# EAGLE design VoltageRegulationBoard (EAGLE 7.4.0)
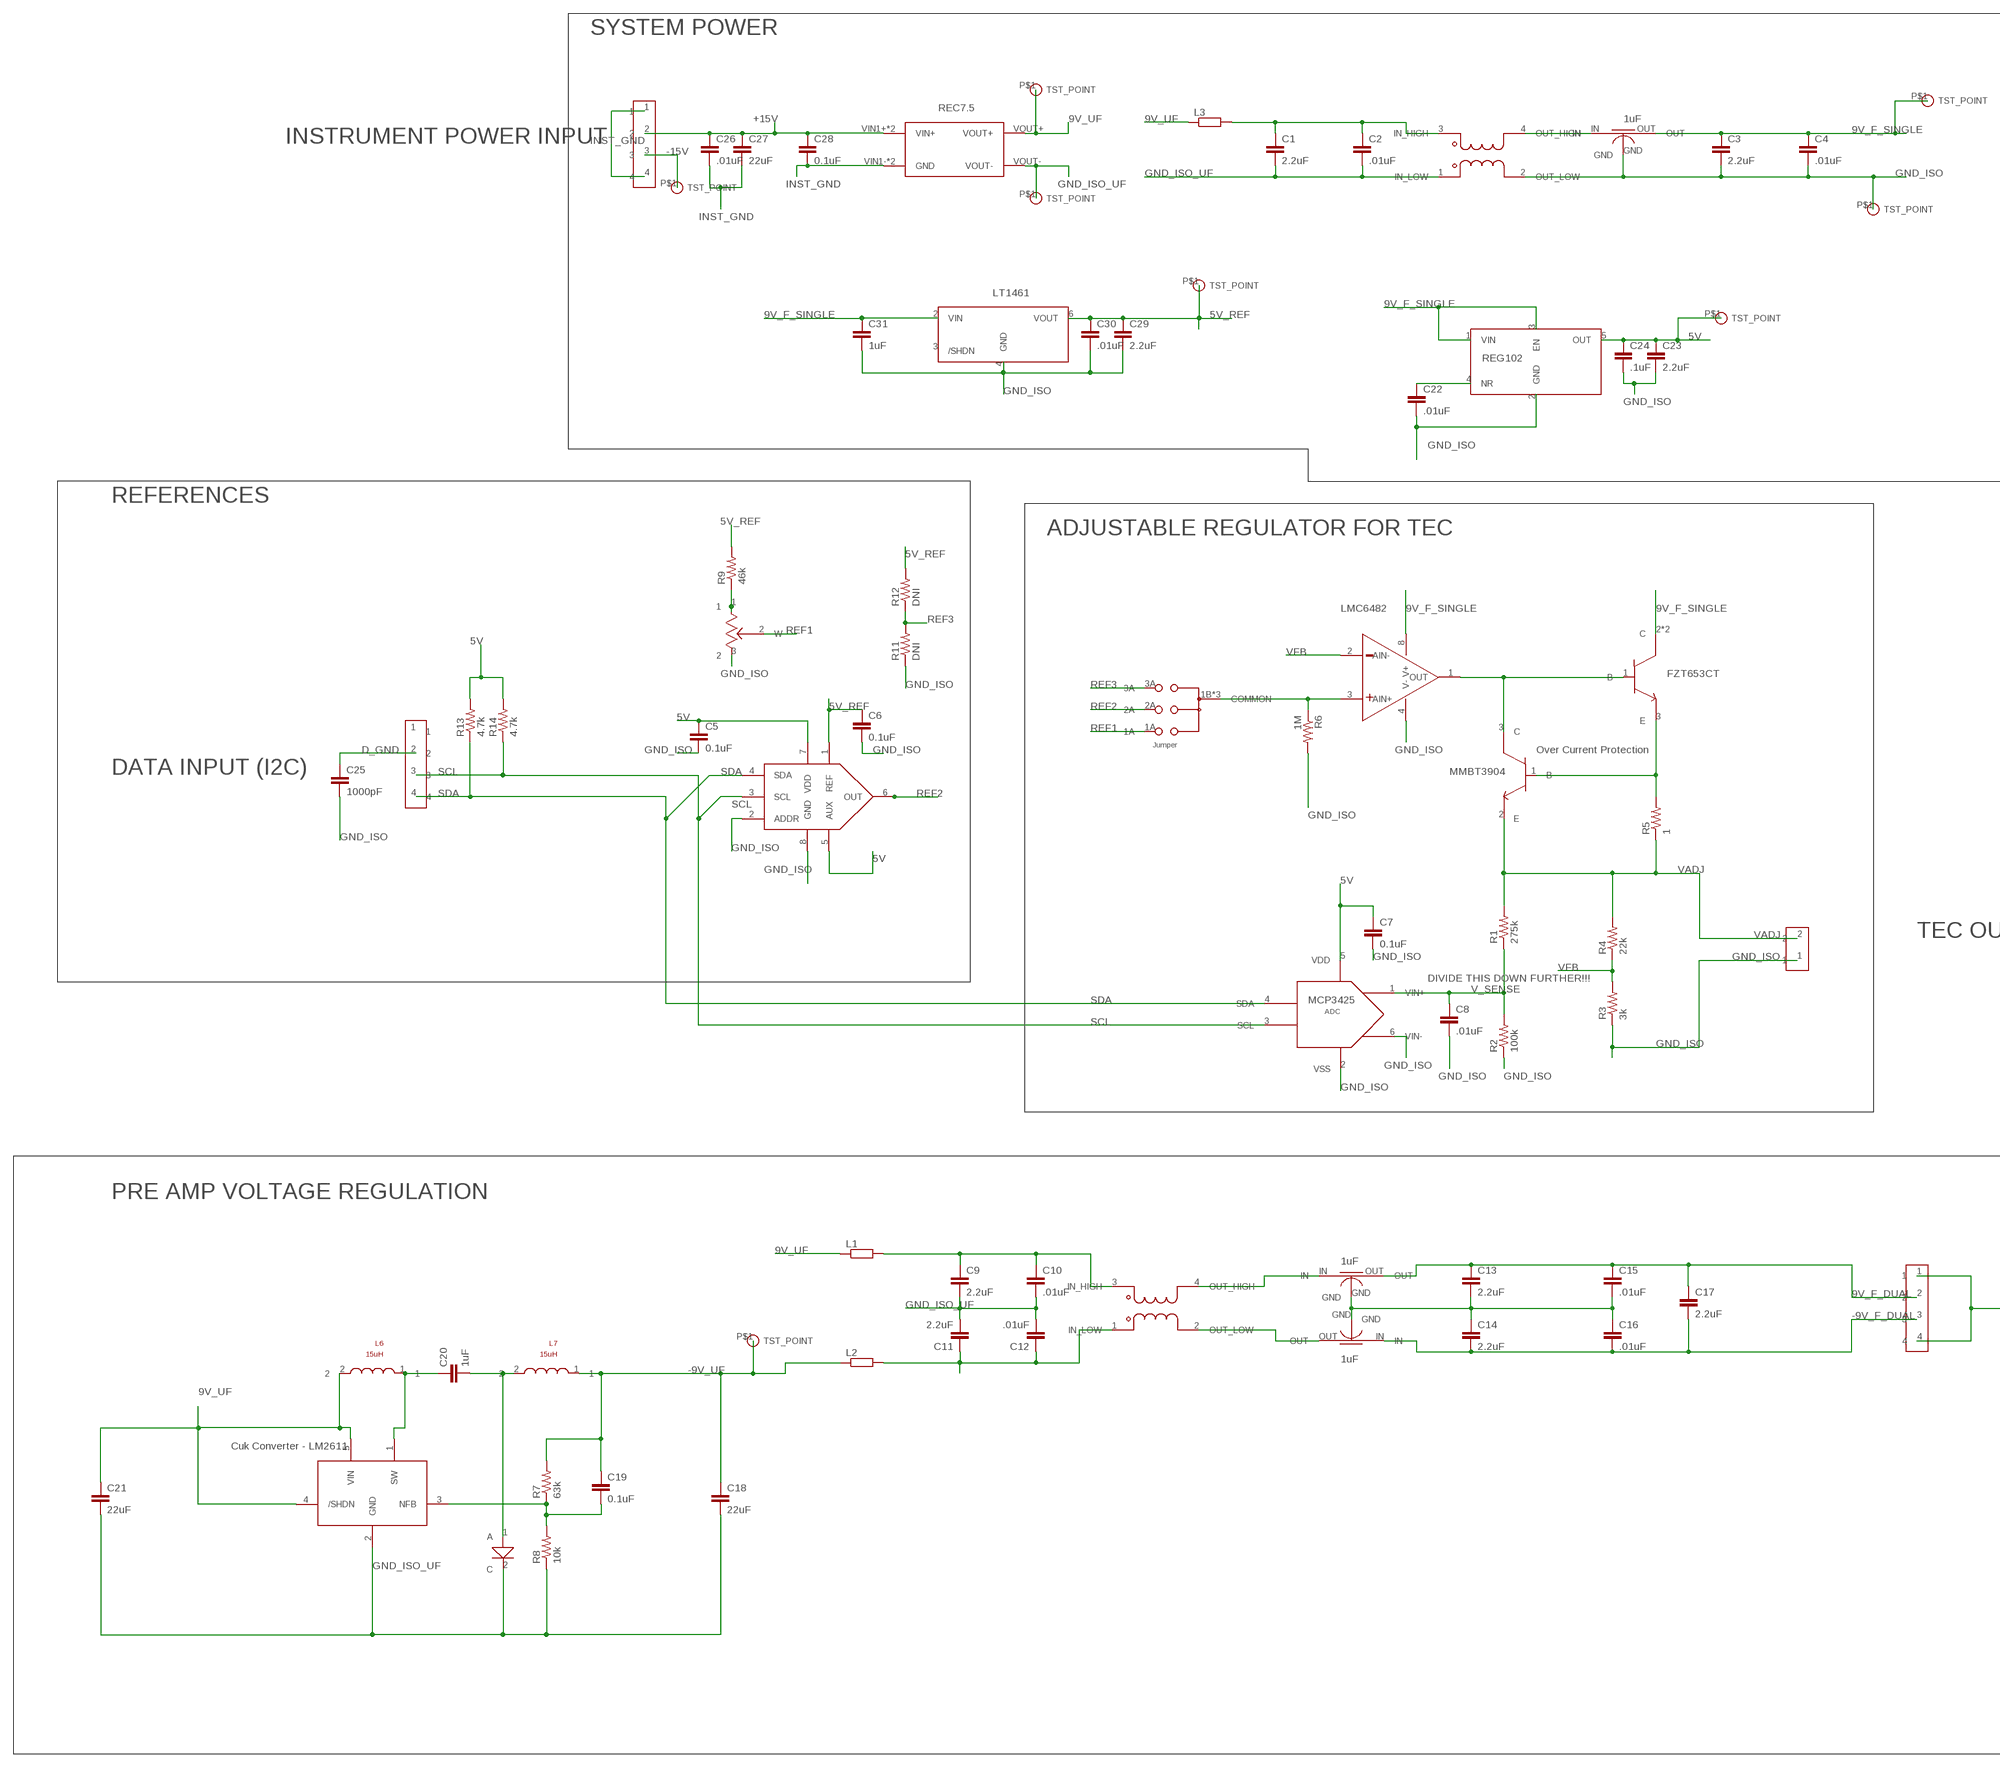
[diagram p0: schematic, sheet 1, part 1 of 2]
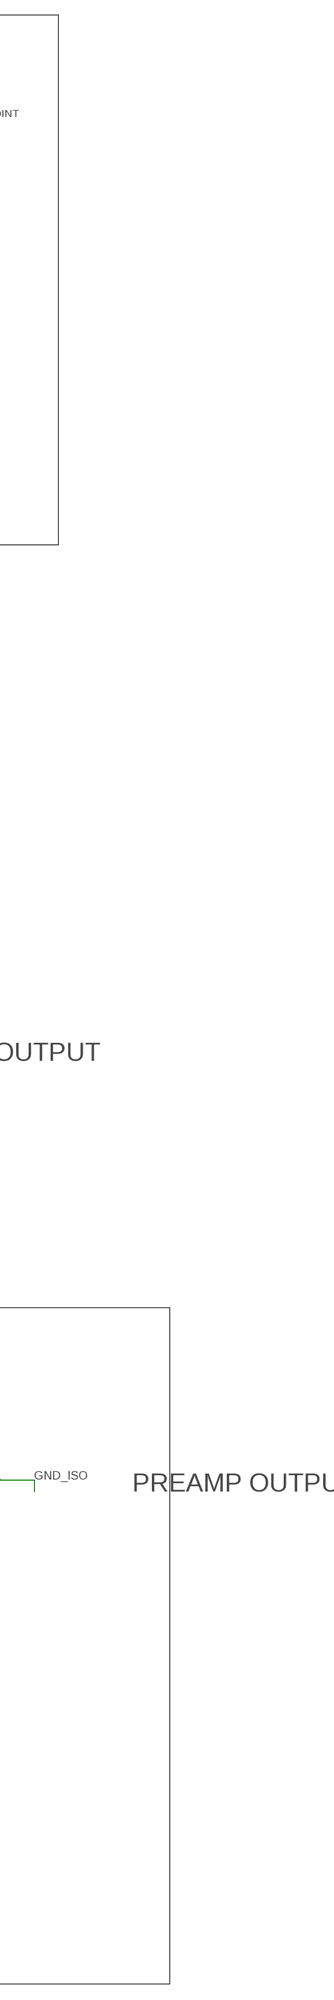
[diagram p1: schematic, sheet 1, part 2 of 2]

## Parts
5V  TST_PT  [TST_POINT]
9V_F_S  TST_PT  [TST_POINT]
9V_UF  TST_PT  [TST_POINT]
-9V_U  TST_PT  [TST_POINT]
-15V  TST_PT  [TST_POINT]
C1  2.2uF  C-EUC0603  [C0603]
C2  .01uF  C-EUC0603  [C0603]
C3  2.2uF  C-EUC0603  [C0603]
C4  .01uF  C-EUC0603  [C0603]
C5  0.1uF  C-EUC0603  [C0603]
C6  0.1uF  C-EUC0603  [C0603]
C7  0.1uF  C-EUC0603  [C0603]
C8  .01uF  C-EUC0603  [C0603]
C9  2.2uF  C-EUC0603  [C0603]
C10  .01uF  C-EUC0603  [C0603]
C11  2.2uF  C-EUC0603  [C0603]
C12  .01uF  C-EUC0603  [C0603]
C13  2.2uF  C-EUC0603  [C0603]
C14  2.2uF  C-EUC0603  [C0603]
C15  .01uF  C-EUC0603  [C0603]
C16  .01uF  C-EUC0603  [C0603]
C17  2.2uF  C-EUC0603  [C0603]
C18  22uF  C-EUC1206  [C1206]
C19  0.1uF  C-EUC0603  [C0603]
C20  1uF  C-EUC0603  [C0603]
C21  22uF  C-EUC1206  [C1206]
C22  .01uF  C-EUC0603  [C0603]
C23  2.2uF  C-EUC0603  [C0603]
C24  .1uF  C-EUC0603  [C0603]
C25  1000pF  C-EUC0603  [C0603]
C26  .01uF  C-EUC0603  [C0603]
C27  22uF  C-EUC1206  [C1206]
C28  0.1uF  C-EUC0603  [C0603]
C29  2.2uF  C-EUC0603  [C0603]
C30  .01uF  C-EUC0603  [C0603]
C31  1uF  C-EUC0603  [C0603]
FC1  FEED_THRU_CAP  [3-TERM-CAP]
FC2  FEED_THRU_CAP  [3-TERM-CAP]
FC3  FEED_THRU_CAP  [3-TERM-CAP]
GND_ISO  TST_PT  [TST_POINT]
GND_ISO_UF  TST_PT  [TST_POINT]
J1  4-OUT  [4-THRU]
J2  4-OUT  [4-THRU]
J3  4-OUT  [4-THRU]
J4  2-THRU  [2-THRU-.1]
L1  R-EU_R0603  [R0603]
L2  R-EU_R0603  [R0603]
L3  R-EU_R0603  [R0603]
L4  COMMON_MODE_CHOKE  [COMM_MODE_CHOKE]
L5  COMMON_MODE_CHOKE  [COMM_MODE_CHOKE]
L6  15uH  INDUCTOR  [INDUCTOR_FOOTPRNT]
L7  15uH  INDUCTOR  [INDUCTOR_FOOTPRNT]
R1  275k  R-US_R0603  [R0603]
R2  100k  R-US_R0603  [R0603]
R3  3k  R-US_R0603  [R0603]
R4  22k  R-US_R0603  [R0603]
R5  1  R-US_R2512  [R2512]
R6  1M  R-US_R0603  [R0603]
R7  63k  R-US_R0603  [R0603]
R8  10k  R-US_R0603  [R0603]
R9  46k  R-US_R0603  [R0603]
R10  POTENTIOMETER  [3-THRU]
R11  DNI  R-US_R0603  [R0603]
R12  DNI  R-US_R0603  [R0603]
R13  4.7k  R-US_R0603  [R0603]
R14  4.7k  R-US_R0603  [R0603]
T1  MMBT3904LT1GOSCT-ND(SMALL-SIGNAL-NMOS)  [SOT23]
T2  FZT653-NPNBJT  [SOT223]
U1  LMC6482  [SOIC8]
U2  DAC_UMAX  [8-UMAX]
U3  VREF  [SOIC8]
U4  REC7.5-1209  [REC7.5-1209]
U5  REG102  [SOT-23-5]
U6  MCP3425A0T-E  [SOT-23-6]
U7  LM2611  [SOT-23-5]
U$3  3XJUMPER  [2-THRU]
U$10  SCHOTTKY  [SOD-123]
VREF  TST_PT  [TST_POINT]

## Nets
5V: 5V.P$1(TST_POINT) C5.1 C7.1 C23.1 C24.1 R13.2 R14.2 U2.5(AUX) U2.7(VDD) U5.5(OUT) U6.5(VDD)
5V_REF: C6.1 C29.1 C30.1 R9.2 R12.2 U2.1(REF) U3.6(VOUT) VREF.P$1(TST_POINT)
9V_F_DUAL: C13.1 C15.1 C17.1 FC2.OUT J2.2
9V_F_SINGLE: 9V_F_S.P$1(TST_POINT) C3.1 C4.1 C31.1 FC3.OUT T2.2(C) T2.4(C) U1.8(V+) U3.2(VIN) U5.1(VIN) U5.3(EN)
9V_UF: 9V_UF.P$1(TST_POINT) C21.1 L1.1 L3.1 L6.2 U4.VOUT+ U7.4(/SHDN) U7.5(VIN)
9V_UF1: C1.1 C2.1 L3.2 L5.3(IN_HIGH)
+15V: C26.1 C27.1 C28.1 J1.2 U4.VIN1+(VIN+) U4.VIN2+(VIN+)
-9V_F_DUAL: C14.2 C16.2 C17.2 FC1.IN J2.3
-9V_UF: -9V_U.P$1(TST_POINT) C18.1 C19.1 L2.1 L7.1 R7.2
-15V: -15V.P$1(TST_POINT) J1.3
D_GND: C25.1 J3.2
GND_ISO: C3.2 C4.2 C5.2 C6.2 C7.2 C8.2 C13.2 C14.1 C15.2 C16.1 C22.2 C23.2 C24.2 C25.2 C29.2 C30.2 C31.2 FC1.GND FC2.GND FC3.GND GND_ISO.P$1(TST_POINT) J2.1 J2.4 J4.1 L5.2(OUT_LOW) R2.1 R3.1 R6.2 R10.3 R11.1 U1.4(V-) U2.2(ADDR) U2.8(GND) U3.4(GND) U5.2(GND) U6.2(VSS) U6.6(VIN-)
GND_ISO_UF: C1.2 C2.2 C9.2 C10.2 C11.2 C12.2 C18.2 C21.2 GND_ISO_UF.P$1(TST_POINT) L5.1(IN_LOW) R8.1 U4.VOUT- U7.2(GND) U$10.2(C)
INST_GND: C26.2 C27.2 C28.2 J1.1 J1.4 U4.VIN1-(GND) U4.VIN2-(GND)
N$1: T1.3(C) T2.1(B) U1.1(OUT)
N$2: R9.1 R10.1
N$3: R5.2 T1.1(B) T2.3(E)
N$5: C22.1 U5.4(NR)
N$6: C9.1 C10.1 L1.2 L4.3(IN_HIGH)
N$11: C19.2 R7.1 R8.2 U7.3(NFB)
N$12: C20.1 L6.1 U7.1(SW)
N$13: FC2.IN L4.4(OUT_HIGH)
N$14: FC1.OUT L4.2(OUT_LOW)
N$15: C20.2 L7.2 U$10.1(A)
N$16: C11.1 C12.1 L2.2 L4.1(IN_LOW)
N$17: FC3.IN L5.4(OUT_HIGH)
N$18: R6.1 U1.3(AIN+) U$3.1B(COMMON) U$3.2B(COMMON) U$3.3B(COMMON)
REF1: R10.2(W) U$3.1A
REF2: U2.6(OUT) U$3.2A
REF3: R11.2 R12.1 U$3.3A
SCL: J3.3 R14.1 U2.3(SCL) U6.3(SCL)
SDA: J3.4 R13.1 U2.4(SDA) U6.4(SDA)
V_SENSE: C8.1 R1.1 R2.2 U6.1(VIN+)
VADJ: J4.2 R1.2 R4.2 R5.1 T1.2(E)
VFB: R3.2 R4.1 U1.2(AIN-)
Unconnected: J3.1 U1.5(AIN+) U1.6(AIN-) U1.7(OUT) U3.3(/SHDN)

## Notes on the sheet
- SYSTEM POWER
- REC7.5
- 1uF
- INSTRUMENT POWER INPUT
- LT1461
- REG102
- REFERENCES
- ADJUSTABLE REGULATOR FOR TEC
- LMC6482
- FZT653CT
- Over Current Protection
- DATA INPUT (I2C) | MMBT3904
- TEC OUTPUT
- DIVIDE THIS DOWN FURTHER!!!
- MCP3425
- PRE AMP VOLTAGE REGULATION
- 1uF
- PREAMP OUTPUT
- 1uF

## Library data of the parts
5V 9V_F_S 9V_UF -9V_U -15V GND_ISO GND_ISO_UF VREF = voltageReg:TST_PT
C1-C31 = resistor:C-EU: CAPACITOR, European symbol
FC1-FC3 = voltageReg:FEED_THRU_CAP
J1-J3 = voltageReg:4-OUT
J4 = voltageReg:2-THRU
L1-L3 = resistor:R-EU_: RESISTOR, European symbol
L4 L5 = voltageReg:COMMON_MODE_CHOKE
L6 L7 = voltageReg:INDUCTOR
R1-R9 R11-R14 = resistor:R-US_: RESISTOR, American symbol
R10 = voltageReg:POTENTIOMETER
T1 = voltageReg:MMBT3904LT1GOSCT-ND(SMALL-SIGNAL-NMOS)
T2 = voltageReg:FZT653-NPNBJT
U1 = foe-scale:LMC6482
U2 = voltageReg:DAC_UMAX
U3 = voltageReg:VREF
U4 = voltageReg:REC7.5-1209
U5 = voltageReg:REG102
U6 = voltageReg:MCP3425A0T-E
U7 = voltageReg:LM2611
U$3 = voltageReg:3XJUMPER
U$10 = voltageReg:SCHOTTKY

## Board
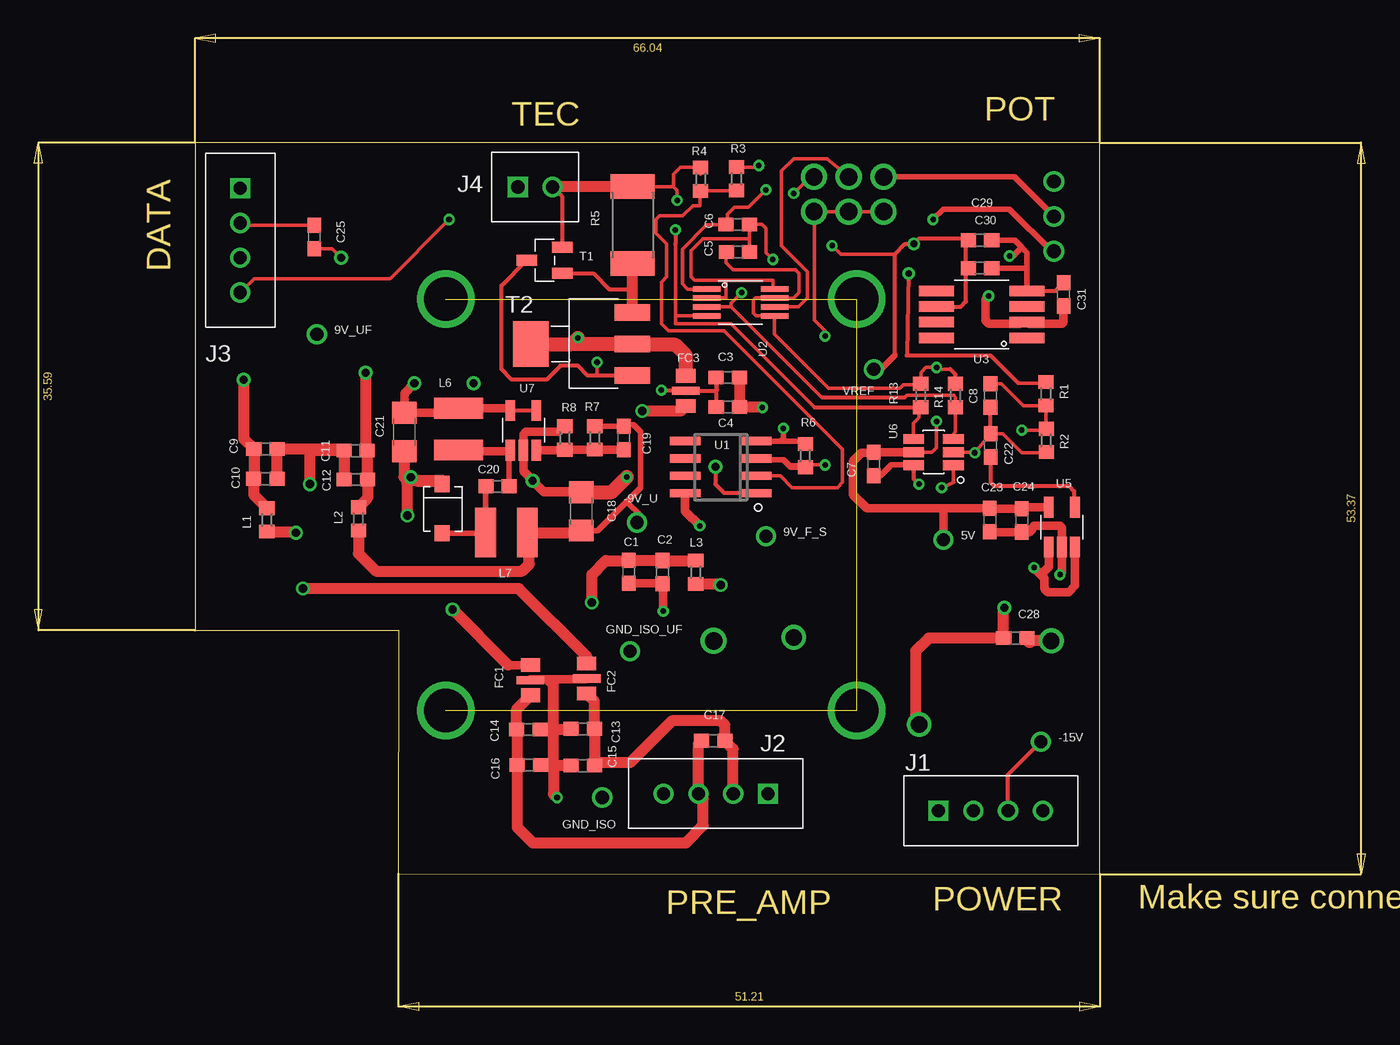
[diagram p2: board, top side]
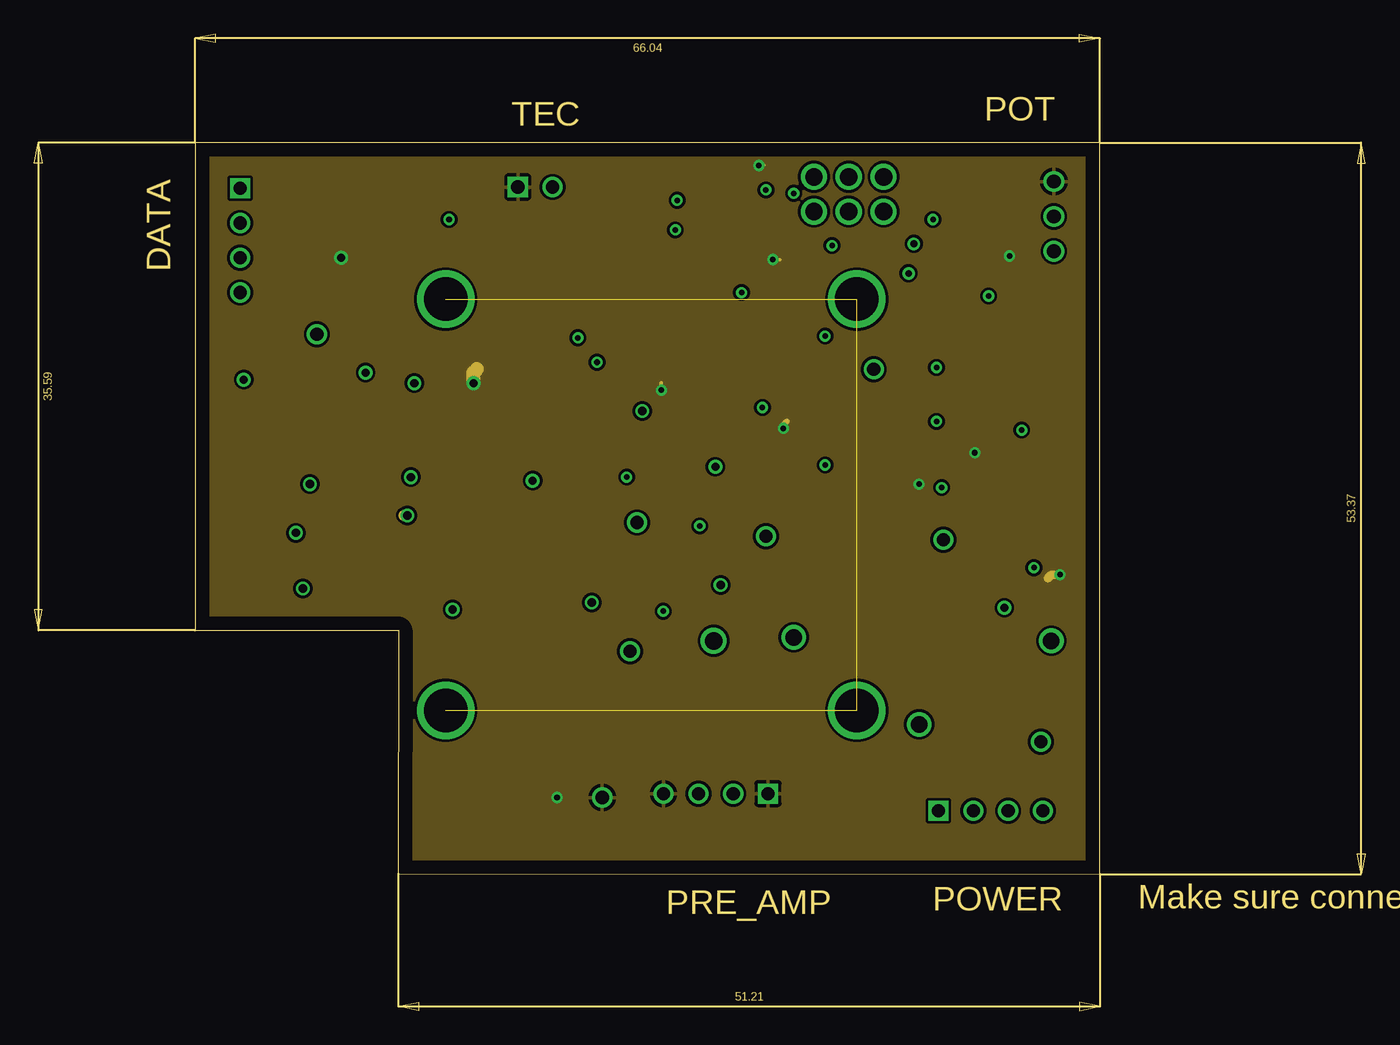
[diagram p3: board, inner layer Route2]
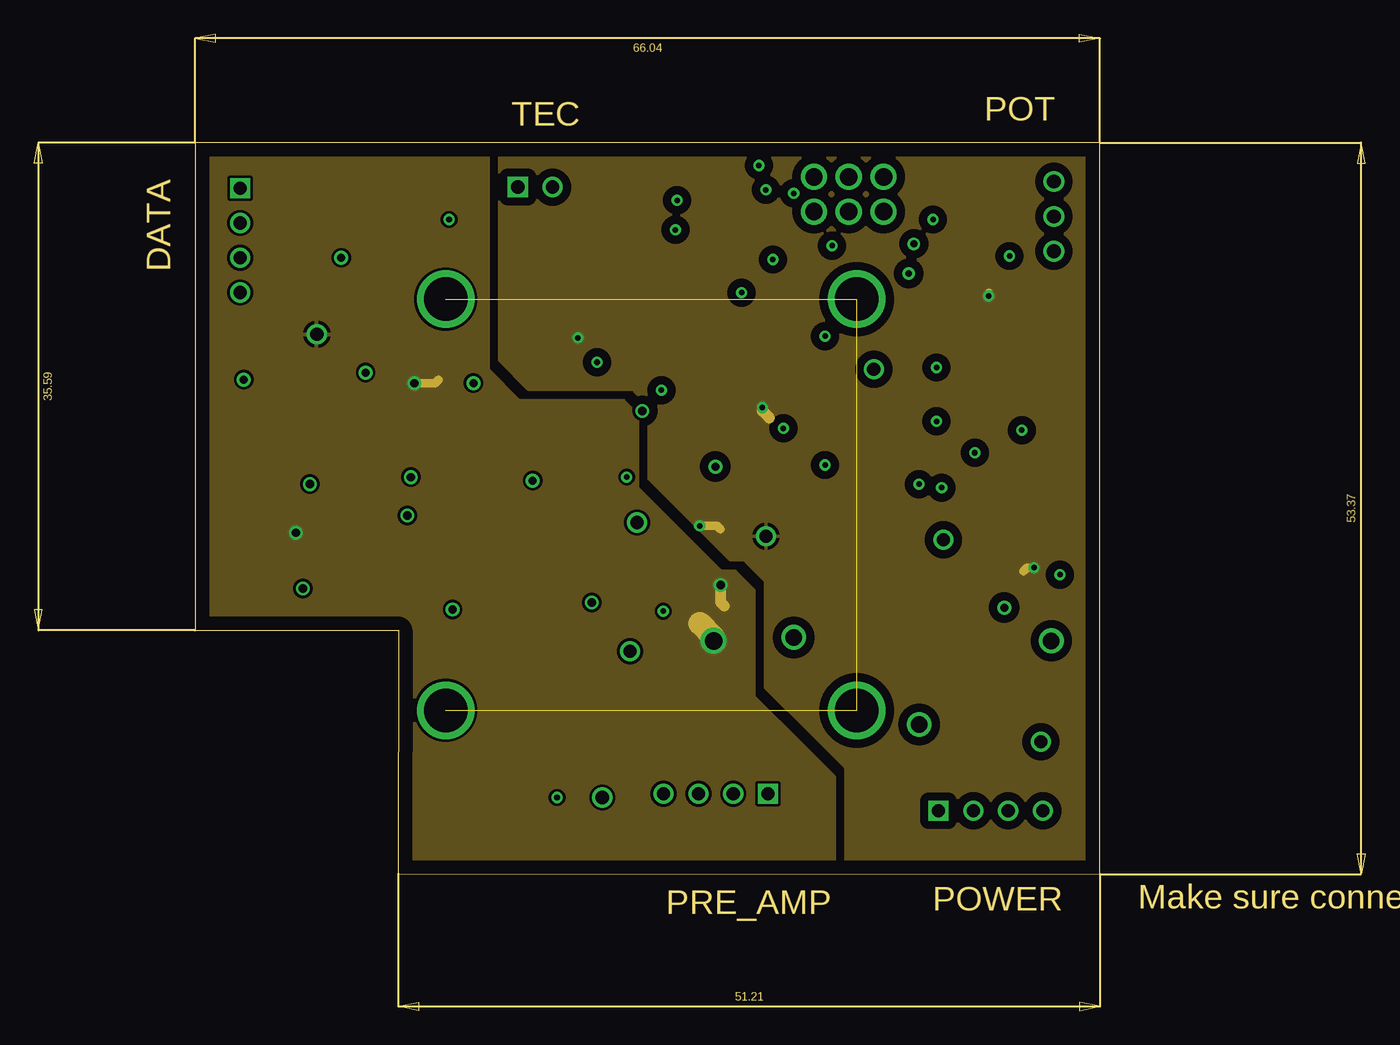
[diagram p4: board, inner layer Route15]
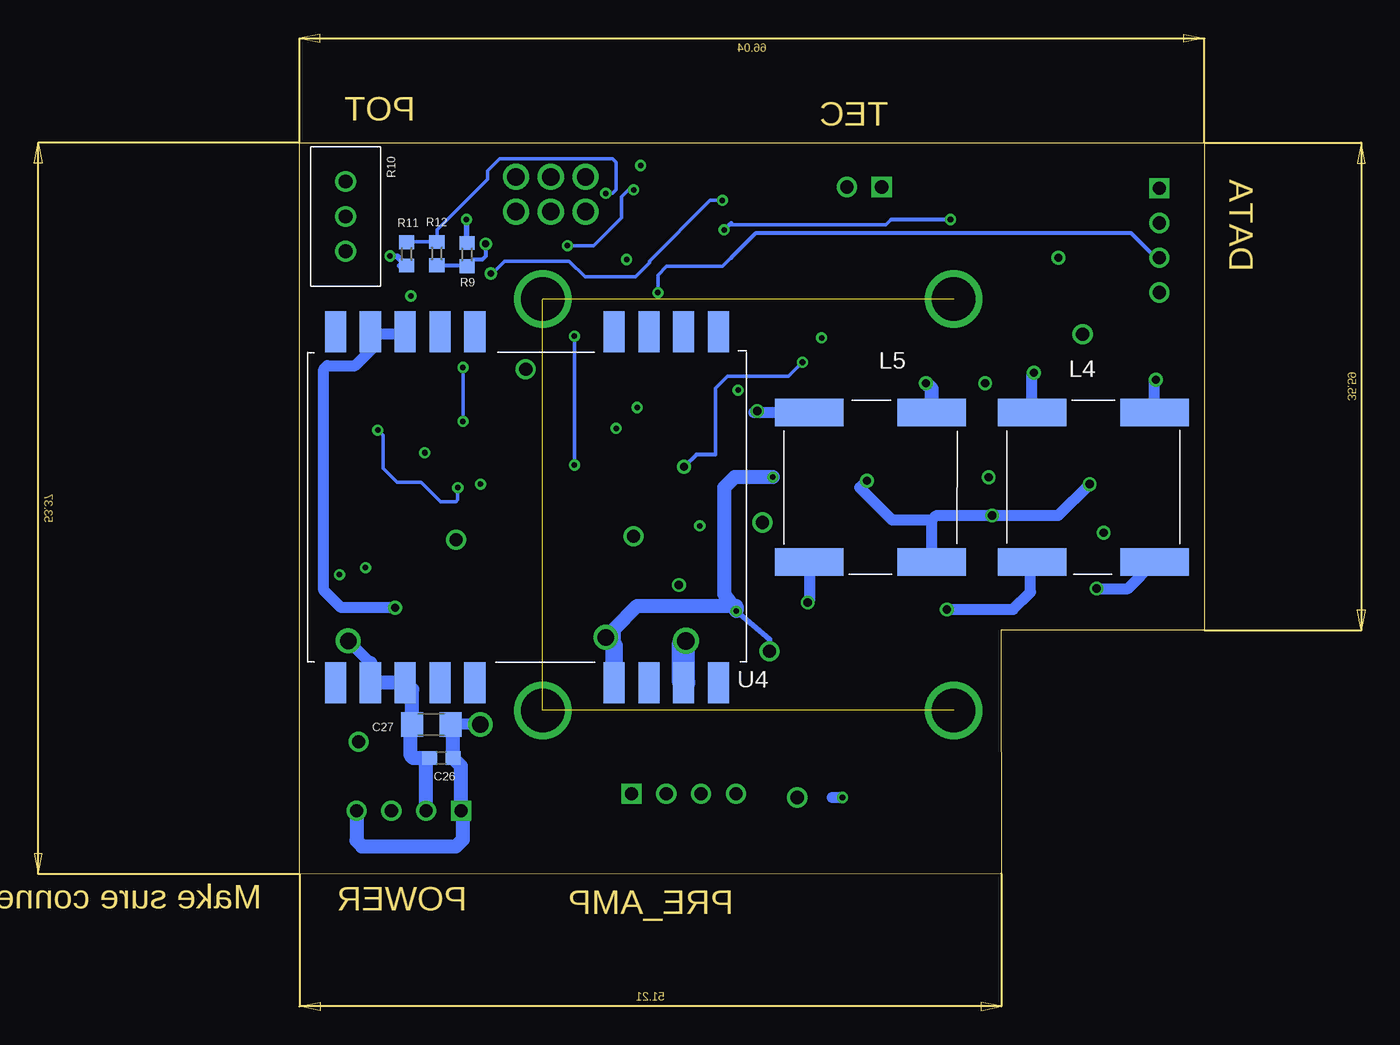
[diagram p5: board, bottom side, seen from below]

Size 66.04 x 53.37 mm. Coordinates in mm from the lower left corner, seen from the top.
Outline: 14.83,0.03 66.04,0 66.04,53.37 0,53.37 0,17.78 14.84,17.78 14.83,0.03
Copper layers (1*2+15*16): Top 0.035mm / dielectric 1.5mm / Route2 0.035mm / dielectric 0.15mm / Route15 0.035mm / dielectric 0.2mm / Bottom 0.035mm
Design rules "default *": minimum track width 10mil, minimum drill 12mil, track to track 8mil, track to pad 8mil, pad to pad 8mil, via to via 8mil, smd to smd 8mil, copper to edge 40mil, drill to drill 8mil, minimum pad ring 10mil, minimum via ring 8mil, stop-mask expansion 4mil, vias tented up to drill 0mil, thermal gap 10mil

### Footprints (pad centres in the part's own frame; a part is rotated, then mirrored left to right if it is on the bottom)
TST_POINT = drill 0.965: P$1 0,0
C0603 = smd 1.1 x 1: 1 -0.85,0; 2 0.85,0
C1206 = smd 1.6 x 1.8: 1 -1.4,0; 2 1.4,0
3-TERM-CAP = smd 0.6 x 2: GND 1.1,0 | smd 1 x 1.4: IN 0,0; OUT 2.2,0
4-THRU = drill 0.965 square: 1 0,0 | drill 0.965: 2 2.54,0; 3 5.08,0; 4 7.62,0
2-THRU-.1 = drill 0.965 square: 1 0,1.27 | drill 0.965: 2 0,-1.27
R0603 = smd 1 x 1.1: 1 -0.85,0; 2 0.85,0
COMM_MODE_CHOKE = smd 5 x 2: 1 0,10.89; 2 0,0; 3 8.93,10.89; 4 8.93,0
INDUCTOR_FOOTPRNT = smd 1.5 x 3.6: 1 0,0; 2 3.05,0
R2512 = smd 1.8 x 3.2: 1 -2.8,0; 2 2.8,0
3-THRU = drill 1: 1 0,0; 2 2.54,0; 3 5.08,0
SOT23 = smd 0.8 x 1.5: 1 0,0; 2 1.9,0; 3 0.95,2.6
SOT223 = smd 1.2 x 2.6: 1 -2.3,0; 2 0,0; 3 2.3,0 | smd 3.3 x 2.6: 4 0,7.4
SOIC8 = smd 0.6 x 2.2: 1 -1.905,-2.6; 2 -0.635,-2.6; 3 0.635,-2.6; 4 1.905,-2.6; 5 1.905,2.6; 6 0.635,2.6; 7 -0.635,2.6; 8 -1.905,2.6
8-UMAX = smd 0.4 x 2: 1 0,0; 2 0.65,0; 3 1.3,0; 4 1.95,0; 5 1.95,4.95; 6 1.3,4.95; 7 0.65,4.95; 8 0,4.95
SOIC8' = smd 0.762 x 2.54: 1 0,0; 2 1.143,0; 3 2.286,0; 4 3.429,0; 5 3.429,6.604; 6 2.286,6.604; 7 1.143,6.604; 8 0,6.604
REC7.5-1209 = smd 1.54 x 3: NC 0,25.61; NC1 0,0; NC2 7.62,0; NC3 10.16,0; NC4 22.86,0; NC5 27.94,0; NC6 27.94,25.61; NC7 25.4,25.61; NC8 22.86,25.61; NC9 20.32,25.61; NC10 10.16,25.61; NC11 7.62,25.61; VIN1+ 2.54,0; VIN1- 5.08,25.61; VIN2+ 5.08,0; VIN2- 2.54,25.61; VOUT+ 25.4,0; VOUT- 20.32,0
SOT-23-5 = smd 0.7 x 1.5: 1 0,0; 2 0.95,0; 3 1.9,0; 4 1.9,2.9; 5 0,2.9
SOT-23-6 = smd 0.7 x 1.5: 1 0,0; 2 0.95,0; 3 1.9,0; 4 1.9,2.9; 5 0.95,2.9; 6 0,2.9
2-THRU = drill 1.27: 1A 0,0; 1B 2.54,0; 2A 0,-2.54; 2B 2.54,-2.54; 3A 0,-5.08; 3B 2.54,-5.08
SOD-123 = smd 1.1 x 1.2: 1 0,0; 2 0,3.59

### Placement (x,y rotation side)
5V  54.61,24.38 0 top
9V_F_S  41.66,24.64 0 top
9V_UF  8.89,39.37 0 top
-9V_U  32.26,25.65 180 top
-15V  61.72,9.65 0 top
C1  31.65,22.05 270 top
C2  34.11,22.02 270 top
C3  38.87,36.23 180 top
C4  38.88,34.08 180 top
C5  39.62,45.38 0 top
C6  39.61,47.39 0 top
C7  49.52,29.92 270 top
C8  58.03,34.91 270 top
C9  5.15,31.01 0 top
C10  5.13,28.84 0 top
C11  11.72,30.89 180 top
C12  11.73,28.79 180 top
C13  28.3,10.6 180 top
C14  24.32,10.55 180 top
C15  28.29,7.91 180 top
C16  24.36,7.96 180 top
C17  37.81,9.73 180 top
C18  28.19,26.46 90 top
C19  31.28,31.82 270 top
C20  22.08,28.29 180 top
C21  15.28,32.26 270 top
C22  58.05,31.27 90 top
C23  57.99,25.82 270 top
C24  60.32,25.8 270 top
C25  8.7,46.47 270 top
C26  55.69,8.46 0 bottom
C27  56.41,10.91 0 bottom
C28  59.85,17.22 180 top
C29  57.28,46.23 0 top
C30  57.28,44.2 0 top
C31  63.37,42.29 90 top
DRILEGEND  [DRILEGEND]  -13.45,-15.48 0 top  (outside the outline)
FC1  24.48,13.05 90 top
FC2  28.57,15.37 270 top
FC3  35.82,34.15 90 top
GND_ISO  29.72,5.59 0 top
GND_ISO_UF  31.75,16.26 0 top
J1  54.25,4.62 0 top
J2  41.81,5.87 180 top
J3  3.3,50.04 270 top
J4  24.83,50.11 90 top
L1  5.25,25.84 90 top
L2  11.93,25.91 90 top
L3  36.54,22.02 90 top
L4  12.58,22.77 0 bottom
L5  19.9,33.66 180 bottom
L6  19.23,30.93 90 top
L7  24.25,24.91 180 top
R1  62.09,35.04 90 top
R2  62.11,31.64 90 top
R3  39.52,50.72 270 top
R4  36.89,50.68 90 top
R5  31.94,47.35 270 top
R6  44.53,30.52 90 top
R7  29.17,31.82 90 top
R8  26.98,31.81 270 top
R9  53.8,45.19 270 bottom
R10  62.67,45.43 90 bottom
R11  58.23,45.24 90 bottom
R12  56.02,45.26 270 bottom
R13  52.95,34.91 90 top
R14  55.49,34.91 90 top
T1  26.8,43.83 90 top
T2  31.91,38.67 90 top
U1  38.37,29.68 90 top
U2  37.34,42.67 270 top
U3  VREF  [SOIC8']  60.71,39.12 90 top
U4  63.4,13.96 0 bottom
U5  62.3,23.86 0 top
U6  55.34,29.82 90 top
U7  23.02,30.92 0 top
U$3  50.24,50.86 270 top
U$10  18.04,24.86 0 top
VREF  49.53,36.83 0 top

### Tracks (layer width: path | path; a pad name or v marks a point on that pad's centre or on a via)
2  (via drill 3.17)  (3 unrouted)
  other vias: 18.29,11.94 48.29,11.94 48.29,41.94 18.29,41.94
5V  (via drill 0.41)
  Top 0.254: U6.5 53.76,30.77 54.1,31.12 v54.1,33.02 | 52.96,35.77 52.96,36.58 53.34,36.96 v54.1,36.96 54.23,36.83 55.12,36.83 | 52.9,35.81 R13.2 52.88,35.69 51.69,35.69 51.44,35.43 46.23,35.43 42.29,39.37 U2.5 40.94,40.72 40.77,40.89 40.77,41.91 40.89,42.04 42.78,42.04 42.8,42.02 | U2.7 42.8,42.02 | 42.8,42.02 43.67,42.02 44.07,42.42 44.07,43.81 43.81,44.07 39.24,44.07 38.73,44.58 38.73,45.35 C5.1
  Top 0.305: R14.2 55.49,36.46 55.12,36.83
  Top 0.61: U5.5 60.35,26.76 C24.1 58.48,26.65 C23.1 54.61,26.67 | 54.61,26.67 49.02,26.67 48.01,27.69 48.01,30.1 48.64,30.73 49.49,30.73 C7.1 U6.5 | 5V.P$1 54.61,26.67 | 52.96,35.77 R13.2
  Bottom 0.254: v54.1,33.02 v54.1,36.96
5V_REF  (via drill 0.41, 0.5)
  Top 0.254: U2.1 35.94,42.67 35.56,43.05 35.56,45.59 37.34,47.37 38.87,47.37 | 38.87,47.37 C6.1 | 38.87,47.37 38.87,48.14 39.37,48.64 40.39,48.64 v41.66,49.91 | 51.05,45.21 47.12,45.21 v46.48,45.85
  Top 0.305: U3.6 55.88,41.4 56.26,41.78 56.26,44.03 | 56.26,44.03 C30.1 | 56.26,44.03 56.26,46.06 | 56.26,46.06 C29.1 | 56.26,46.06 56.26,46.36 52.83,46.36 v52.45,45.97 51.82,45.97 51.05,45.21 51.05,40.51 51.05,39.88 51.05,37.85
  Top 0.406: VREF.P$1 50.04,36.83 51.05,37.85
  Bottom 0.254: v41.66,49.91 42.04,49.91 42.55,49.4 42.55,47.88 44.58,45.85 v46.48,45.85
  Bottom 0.305: v52.45,45.97 52.45,45.09 52.7,44.83 53.31,44.83 R9.2 53.88,44.41 R12.2
9V_F_DUAL
  Top 0.61: C15.1
  Top 0.813: FC2.OUT 29.15,12.6 C13.1 C15.1 | J2.2 39.27,9.12 C17.1 38.66,10.87 38.35,11.18 34.8,11.18 31.75,8.13 29.35,8.13 C15.1
9V_F_SINGLE  (via drill 0.41)
  Top 0.61: U1.8 35.77,26.46 v36.83,25.4 | C31.1 63.37,40.26 63.25,40.13 60.83,40.13 U3.2 60.33,40.26 60.2,40.13 57.91,40.13 57.66,40.39 57.66,41.91 v57.91,42.16 | U5.3 64.2,21.02 63.75,20.57 62.23,20.57 61.98,20.83 61.98,21.59 61.72,21.84 | 61.72,21.84 v61.21,22.35 | U5.1 62.3,22.42 61.72,21.84
  Top 0.813: C3.1 39.72,34.09 C4.1 41.36,34.08 v41.4,34.04
  Top 1.016: T2.4 27.49,38.67 | 27.49,38.67 v27.94,39.12 | 27.49,38.67 T2.2 31.97,38.61 35.05,38.61 35.82,37.84 FC3.OUT
  Route15 0.61: v36.83,25.4 38.1,25.4 38.35,25.15 | v57.91,42.16 57.91,42.42 | v61.21,22.35 60.71,22.35 60.45,22.1
  Route15 0.813: v41.4,34.04 41.4,33.78 41.91,33.27
  pour Route15 (isolate 0.61, rank 2): 22.23,53.09 22.23,1.52 25.65,0.13 65.28,0.13 65.91,0.76 65.91,51.82 65.66,53.34 23.5,53.34
9V_UF  (via drill 0.6, 1.27 pad 1.02)
  Top 0.305: U7.5 U7.4
  Top 0.61: U7.5 22.86,33.98 L6.2 18.91,33.66 C21.1 15.28,35.09 v16,35.81
  Top 0.813: L1.1 7.27,24.99 v7.37,24.89 | L3.1 38.27,21.17 v38.35,21.08
  Route15 0.61: v16,35.81 17.53,35.81 17.78,36.07
  Route15 0.813: v38.35,21.08 38.35,19.81 38.61,19.56
  Route15 1.676: v37.85,17.02 37.85,17.27 36.83,18.29
  Bottom 1.676: U4.VOUT+ 38,16.86 v37.85,17.02
  pour Route15: -2.54,53.47 21.34,53.47 21.34,36.83 23.62,34.54 31.24,34.54 32.26,33.53 32.26,28.19 38.35,22.1 39.37,22.1 40.77,20.7 40.77,12.95 44.32,9.4 46.61,7.11 46.61,-0.38 46.1,-0.89 14.48,-0.89 13.97,-0.38 13.97,14.48 11.94,16.51 0.13,16.51 -0.89,16.51 -2.16,17.78 -2.16,53.09
9V_UF1  (via drill 0.6)
  Top 0.813: v28.96,19.81 28.96,21.84 29.97,22.86 31.61,22.86 C1.1 34.08,22.9 C2.1 L3.2
  Bottom 0.813: L5.3 28.83,19.94 v28.96,19.81
+15V  (via drill 1.2)
  Top 0.813: v62.48,17.02 60.9,17.02
  Top 1.016: 60.9,17.02 C28.1
  Bottom 0.813: 60.86,15.4 v62.48,17.02
  Bottom 1.016: J1.2 56.79,8.21 C26.1 57.74,8.46 57.91,8.64 57.91,11.01 | 57.91,11.43 57.91,11.01 | 57.91,11.01 C27.1 57.81,13.45 U4.VIN2+ U4.VIN1+ 60.86,15.4
-9V_F_DUAL
  Top 0.61: C14.2 23.51,10.55
  Top 0.813: 23.51,10.55 C16.2 23.51,3.41 24.64,2.29 35.81,2.29 37.08,3.56 37.08,5.52 J2.3 36.73,9.5 C17.2 | C14.2 23.47,12.04 FC1.IN
-9V_UF
  Top 0.406: C18.1 29.38,25.06 31.5,27.18 | 29.33,32.51 R7.2 C19.1 31.38,32.77 32,32.77 32.51,32.26 32.51,28.19 31.5,27.18 | 31.5,27.18 32.51,26.16 32.51,25.91 -9V_U.P$1
  Top 0.813: L2.1 11.93,23.38 13.21,22.1 23.88,22.1 24.38,22.61 24.38,24.77 L7.1 28.03,24.91 C18.1
-15V
  Top 0.305: J1.3 59.33,7.26 -15V.P$1
D_GND
  Top 0.254: C25.1 3.48,47.32 J3.2
GND_ISO  (via drill 0.41, 0.6)
  Top 0.254: U6.2 56.6,30.77 v56.9,30.73 58.03,32.12 C22.2 58.94,32.12 60.33,30.73 62.06,30.73 R2.1 | C25.2 10,45.62 v10.67,44.96 | U2.2 37.34,42.04 38.73,42.04 38.73,43.31 | 38.73,43.31 36.45,43.31 36.2,43.56 36.2,45.47 37.08,46.36 40.39,46.36 40.47,46.27 C5.2 40.47,47.38 C6.2 41.39,47.39 41.66,47.12 41.66,45.34 v42.16,44.83 | 38.73,43.31 42.16,43.31 42.16,42.8 U2.8 | R3.1 41.03,51.57 v41.15,51.69
  Top 0.305: C4.2 38.02,34.09 C3.2 38.1,36.16 38.1,35.31 38.05,35.25 FC3.GND 34.09,35.25 v34.04,35.31 | C22.2 58.05,34.04 C8.2 | U6.6 52.44,28.84 v52.83,28.45 | U3.4 62.78,42.55 C31.2 | C30.2 58.55,44.2
  Top 0.406: R6.2 44.31,31.59 U1.4 42.77,31.59 42.93,31.75 v42.93,32.51 | C7.2 50.02,29.07 50.8,29.84 52.42,29.84 U6.6 | U3.4 60.71,44.2 | 60.71,44.2 60.71,45.34 60.33,45.72 | 26.16,13.97 26.42,14.22 | C29.2 59.82,46.23 60.33,45.72 | C30.2 60.71,44.2 | 60.33,45.72 59.69,45.09 v59.44,45.09
  Top 0.61: v63.12,21.84 63.25,21.98 U5.2 63.25,25.27 63.12,25.4 61.21,25.4 61.09,25.27 61.09,25.15 60.89,24.95 C24.2 58.01,24.95 C23.2 | 27.45,10.55 C13.2 | 26.16,7.96 26.16,7.87 | 25.65,14.22 24.48,14.22 FC1.GND | 25.65,14.22 28.52,14.22 FC2.GND | 26.16,13.97 25.91,13.97 25.65,14.22
  Top 0.813: 26.16,10.55 26.16,13.97 | C14.1 26.16,10.55 | 26.16,10.55 27.45,10.55 | 26.16,7.87 26.16,5.84 v26.42,5.59 | C15.2 27.4,7.96 26.16,7.96 C16.1 26.08,7.96 26.16,7.87 | 26.16,7.87 26.16,10.55
  Route2 0.254: v42.16,44.83 42.67,44.83 | v41.15,51.69 41.53,51.69
  Route2 0.305: v34.04,35.31 34.04,35.81
  Route2 0.406: v42.93,32.51 42.93,32.77 43.18,33.02
  Route2 0.61: v63.12,21.84 62.48,21.84 62.23,21.59
  Route2 1.016: v20.32,35.81 20.32,36.58 20.57,36.83
  Bottom 0.406: 58.74,44.39 R11.1 58.93,45.09 v59.44,45.09
  Bottom 0.813: v26.42,5.59 27.18,5.59
  Bottom 1.016: L5.2 19.9,35.39 v20.32,35.81
  pour Route2: -2.03,53.85 -2.03,-3.3 67.82,-3.3 67.82,55.12 -2.03,55.12
GND_ISO_UF  (via drill 0.41, 0.6, 1.2)
  Top 0.254: C1.2 34.08,21.2 C2.2
  Top 0.406: U$10.2 16.25,28.45 v15.75,28.96 15.24,29.46 15.24,30.82 C21.2
  Top 0.61: C1.2 34.04,21.2 34.16,21.08 v34.16,19.18 | 25.4,27.94 v24.64,28.7 23.97,29.37 U7.2 23.97,32.09 24.13,32.26 26.58,32.26 R8.1 | 25.4,27.94 28.11,27.94 C18.2 25.48,27.86 25.4,27.94
  Top 0.813: C11.2 10.75,31.01 C9.2 5.98,30.99 C10.2 | C11.2 10.87,28.8 C12.2 | C11.2 8.54,30.89 8.38,30.73 v8.38,28.45 | 15.49,28.45 15.49,28.7 | 15.49,28.7 v15.75,28.96 | 15.24,30.82 15.24,28.96 15.49,28.7 | 15.49,28.7 15.75,28.7 | 18.03,28.7 15.75,28.7 | 15.75,28.7 15.49,28.45 | 15.49,28.45 v15.49,26.16
  Top 1.016: C18.2 30.4,27.86 v31.5,28.96
  Route2 0.406: v15.75,28.96 15.75,28.7
  Route2 0.813: v15.49,26.16 15.24,26.16
  Route2 1.27: v43.69,17.27 43.94,17.27
  Bottom 0.406: GND_ISO_UF.P$1 31.75,17.14 v34.16,19.18
  Bottom 0.813: L5.1 19.9,25.82 | 19.9,25.82 19.56,26.16 v15.49,26.16 10.67,26.16 v8.38,28.45 | 19.9,25.82 22.77,25.82 25.15,28.19 v24.64,28.7
  Bottom 1.016: 43.08,16.67 43.08,17.88 41.4,19.56 34.16,19.56 v34.16,19.18 35.05,20.45 35.05,28.19 34.29,28.96 v31.5,28.96
  Bottom 1.27: U4.VOUT- 43.08,16.67 v43.69,17.27
INST_GND  (via drill 0.6, 1.2)
  Top 0.61: 54.25,4.65 J1.1 54.25,4.76
  Top 0.813: 52.58,11.18 52.58,16.26 53.54,17.21 C28.2 59,19.38 v59.06,19.43
  Top 1.016: 52.58,11.18 v52.83,10.92
  Bottom 0.813: v52.83,10.92 55,10.92 | 60.71,39.41 60.71,38.35 61.98,37.08 64.01,37.08 64.26,36.83 64.26,20.7 62.99,19.43 v59.06,19.43 | 60.71,39.41 U4.VIN2- | 60.71,39.41 58.48,39.41 U4.VIN1-
  Bottom 1.016: J1.4 61.87,2.44 61.47,2.03 54.61,2.03 54.1,2.54 54.1,4.47 J1.1 54.25,7.87 C26.2 54.84,10.74 C27.2 55,10.92
N$1  (via drill 0.41, 0.6)
  Top 0.254: 39.28,27.78 39.24,27.81 | v29.34,37.34 29.34,36.49 29.46,36.37
  Top 0.305: T2.1 29.46,36.37 28.66,36.37 27.94,37.08 26.67,37.08 25.65,36.07 23.11,36.07 22.35,36.83 22.35,42.93 T1.3 | v37.97,29.72 37.97,28.45 38.61,27.81 39.24,27.81 40.94,27.81 U1.1
  Bottom 0.254: 35.69,30.61 35.69,35.43 34.8,36.32 30.35,36.32 v29.34,37.34
  Bottom 0.305: 35.69,30.61 37.08,30.61 v37.97,29.72
N$2  (via drill 0.41)
  Top 0.406: R10.1 62.52,45.43 59.44,48.51 54.61,48.51 v53.85,47.75
  Bottom 0.406: v53.85,47.75 53.85,46.08 R9.1
N$3
  Top 0.305: T1.1 29.07,43.83 30.23,42.67 31.91,42.67
  Top 0.813: T2.3 31.91,42.67 31.91,44.01 R5.2
N$5
  Top 0.305: C22.1 58.05,28.57 58.29,28.32 63.75,28.32 64.14,27.94 64.14,26.82 U5.4
N$6  (via drill 0.6)
  Top 0.813: v3.56,36.07 3.56,31.75 C9.1 4.3,28.85 C10.1 4.28,27.66 L1.2
  Bottom 0.813: L4.3 3.65,35.98 v3.56,36.07
N$11
  Top 0.61: U7.3 26.94,30.92 R8.2 R7.1 C19.2
N$12
  Top 0.406: C20.1 22.93,30.83 | 19.33,30.83 L6.1
  Top 0.61: 19.33,30.83 22.93,30.83 U7.1
N$13  (via drill 0.6)
  Top 0.61: FC2.IN 28.57,15.88
  Top 0.813: 28.57,15.88 23.62,20.83 v7.87,20.83
  Bottom 0.813: v7.87,20.83 5.59,20.83 L4.4
N$14  (via drill 0.6)
  Top 0.61: FC1.OUT 22.85,15.25
  Top 0.813: 22.85,15.25 v18.8,19.3
  Bottom 0.61: 12.7,22.65 L4.2
  Bottom 0.813: v18.8,19.3 13.97,19.3 12.7,20.57 12.7,22.65
N$15
  Top 0.406: U$10.1 21.16,24.87 L7.2 21.2,28.26 C20.2
N$16  (via drill 0.6)
  Top 0.813: v12.45,36.58 12.45,31.27 C11.1 12.57,28.8 C12.1 12.58,27.42 L2.2
  Bottom 0.813: L4.1 12.58,36.45 v12.45,36.58
N$17  (via drill 0.6)
  Top 0.813: v32.64,33.78 35.45,33.78 FC3.IN
  Bottom 0.813: L5.4 32.9,33.66 v32.64,33.78
N$18  (via drill 0.41)
  Top 0.254: 43.31,29.84 v45.97,29.84 | U$3.1B U$3.2B U$3.3B 45.21,48.27 45.21,40.39 45.97,39.62 v45.97,39.24
  Top 0.406: R6.1 43.48,29.67 43.31,29.84 42.93,30.23 41.06,30.23 U1.3
  Bottom 0.254: v45.97,29.84 v45.97,39.24
REF1
  Top 0.406: U$3.1A 59.78,50.86 R10.2
REF2
  Top 0.254: U2.6 44.04,41.37 44.7,42.04 44.7,43.94 42.8,45.85 42.8,51.31 43.69,52.2 46.11,52.2 U$3.2A
REF3  (via drill 0.41)
  Top 0.254: U$3.3A 44.89,50.86 v43.69,49.66
  Bottom 0.254: v43.69,49.66 43.18,49.66 42.93,49.91 42.93,51.94 43.18,52.2 51.44,52.2 52.32,51.31 52.32,50.67 56.01,46.99 R12.1 58.21,46.11 R11.2
SCL  (via drill 0.41)
  Top 0.254: 51.82,34.8 51.94,34.92 55.37,34.92 55.5,34.8 55.5,34.07 R14.1 55.5,32.26 55.34,32.1 U6.3 | 45.72,34.8 39.12,41.4 | v39.88,42.42 39.12,41.66 39.12,41.4 | 39.12,41.4 37.37,41.4 U2.3
  Top 0.305: 45.72,34.8 51.82,34.8
  Bottom 0.254: 3.56,44.96 J3.3 | v39.88,42.42 39.88,43.69 39.24,44.32 35.18,44.32 34.54,44.96
  Bottom 0.305: 3.56,44.96 5.33,46.74 32.77,46.74 34.54,44.96
SDA  (via drill 0.41)
  Top 0.254: U6.4 52.44,32.88 52.83,33.27 52.83,33.94 52.92,34.04 R13.1 | J3.4 4.32,43.43 14.22,43.43 18.29,47.5 v18.54,47.75 | 45.21,34.04 39.12,40.13 35.05,40.13 35.05,40.77 | 35.05,40.77 v35.05,46.99 | U2.4 35.1,40.72 35.05,40.77
  Top 0.305: v35.05,46.99 35.05,45.97 | 45.21,34.04 52.92,34.04 | v18.54,47.75 18.29,47.75 18.29,47.5
  Bottom 0.254: 22.86,47.75 23.24,47.37 34.67,47.37
  Bottom 0.305: 34.54,47.5 34.67,47.37 v35.05,46.99 | 22.86,47.75 v18.54,47.75
V_SENSE  (via drill 0.41)
  Top 0.254: U6.1 55.34,28.61 55.37,28.58 v54.48,28.19 | v60.33,32.38 62.01,32.38 R2.2 62.09,32.5 R1.1 62.07,34.16 60.45,34.16 58.85,35.76 C8.1
  Bottom 0.254: v60.33,32.38 59.94,32 59.94,29.59 58.93,28.58 57.15,28.58 55.75,27.18 54.61,27.18 54.48,27.3 v54.48,28.19
VADJ  (via drill 0.41, 0.5)
  Top 0.254: R5.1 34.91,50.15 | 36.87,51.05 R4.2 36.87,51.56 35.43,51.56 34.91,51.04 34.91,50.15 | 60.07,35.81 62.02,35.81 R1.2 | v35.18,49.15 35.18,49.87 34.91,50.15
  Top 0.305: T1.2 26.8,49.41 J4.2 | v52.07,43.81 51.94,37.85 58.04,37.85 60.07,35.81
  Top 0.813: R5.1 26.13,50.15 J4.2
  Bottom 0.254: v52.07,43.81 51.94,43.81 51.05,44.7 46.36,44.7 45.21,43.56 41.53,43.56 40.51,44.58 40.51,44.7 36.07,49.15 v35.18,49.15
VFB
  Top 0.254: 36.93,49.36 R4.1 | U1.2 42.71,29.05 43.56,28.19 46.86,28.19 47.24,28.58 47.24,30.99 38.61,39.62 34.54,39.62 34.04,40.13 34.04,43.18 34.42,43.56 34.42,45.97 33.66,46.74 33.66,47.75 33.91,48.01 35.56,48.01 36.32,48.77 36.83,48.77 36.83,49.77 R4.1 | R4.1 39.48,49.84 R3.2

### Text on the board
Dimension: TEC | POT | DATA | Make sure connector is inserted the appropriate way | PRE_AMP | POWER
DrillLegend: LAYER-STACK
DrillLegend_01-16: 01-16